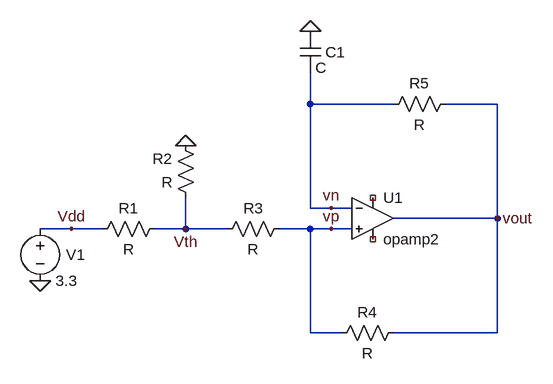
[diagram p0: schematic Draft1.asc]
Draft1.asc, the LTspice schematic file:
Version 4.1
SHEET 1 880 680
WIRE 352 -96 352 -144
WIRE 480 -96 352 -96
WIRE 640 -96 560 -96
WIRE 352 64 352 -96
WIRE 384 64 352 64
WIRE 416 64 384 64
WIRE 640 80 640 -96
WIRE 640 80 480 80
WIRE -16 96 -64 96
WIRE 32 96 -16 96
WIRE 160 96 160 48
WIRE 160 96 112 96
WIRE 224 96 160 96
WIRE 352 96 304 96
WIRE 384 96 352 96
WIRE 416 96 384 96
WIRE 352 256 352 96
WIRE 400 256 352 256
WIRE 640 256 640 80
WIRE 640 256 480 256
FLAG -64 176 0
FLAG 160 -32 0
FLAG 352 -208 0
FLAG -16 96 Vdd
FLAG 160 96 Vth
FLAG 384 96 vp
FLAG 384 64 vn
FLAG 640 80 vout
SYMBOL voltage -64 80 R0
WINDOW 0 40 56 Left 2
WINDOW 123 0 0 Left 0
WINDOW 39 0 0 Left 0
SYMATTR InstName V1
SYMATTR Value 3.3
SYMBOL OpAmps\\opamp2 448 16 R0
SYMATTR InstName U1
SYMBOL res 128 80 R90
WINDOW 0 0 56 VBottom 2
WINDOW 3 32 56 VTop 2
SYMATTR InstName R1
SYMBOL res 176 64 R180
WINDOW 0 36 76 Left 2
WINDOW 3 36 40 Left 2
SYMATTR InstName R2
SYMBOL res 320 80 R90
WINDOW 0 0 56 VBottom 2
WINDOW 3 32 56 VTop 2
SYMATTR InstName R3
SYMBOL res 496 240 R90
WINDOW 0 0 56 VBottom 2
WINDOW 3 32 56 VTop 2
SYMATTR InstName R4
SYMBOL res 576 -112 R90
WINDOW 0 0 56 VBottom 2
WINDOW 3 32 56 VTop 2
SYMATTR InstName R5
SYMBOL cap 336 -208 R0
WINDOW 0 39 32 Left 2
SYMATTR InstName C1

The netlist it stands for:
* Draft1.asc
V1 Vdd 0 3.3
X§U1 vp vn NC_01 NC_02 vout opamp2  ; pins In+ In- V+ V- OUT
R1 Vth Vdd R
R2 Vth 0 R
R3 vp Vth R
R4 vout vp R
R5 vout vn R
C1 0 vn C
.backanno
.end